# Altium schematic sheet BV100011_SDCARD.SchDoc
size A
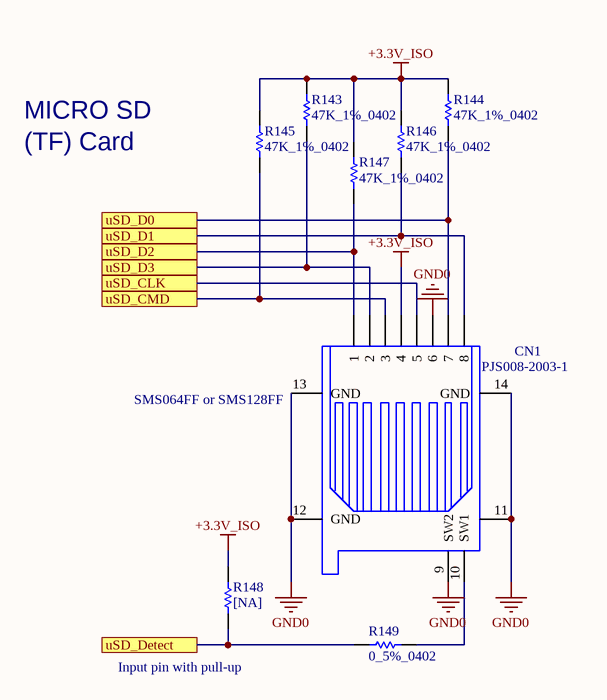
[diagram p0: BV100011_SDCARD.SchDoc]

## Parts
CN1  PJS008-2003-1  [PJS008-2003-1]
R143  47K_1%_0402  [0402R]
R144  47K_1%_0402  [0402R]
R145  47K_1%_0402  [0402R]
R146  47K_1%_0402  [0402R]
R147  47K_1%_0402  [0402R]
R148  [NA]  [0402R]
R149  0_5%_0402  [0402R]

## Ports
uSD_CLK, uSD_CMD, uSD_D0, uSD_D1, uSD_D2, uSD_D3, uSD_Detect

## Nets
+3.3V_ISO: CN1.4 R143.2 R144.2 R145.2 R146.2 R147.2 R148.2
GND0: CN1.6 CN1.9(SW2) CN1.11(GND) CN1.12(GND) CN1.13(GND) CN1.14(GND)
uSD_CLK: CN1.5 ; port uSD_CLK
uSD_CMD: CN1.3 R145.1 ; port uSD_CMD
uSD_D0: CN1.7 R144.1 ; port uSD_D0
uSD_D1: CN1.8 R146.1 ; port uSD_D1
uSD_D2: CN1.1 R147.1 ; port uSD_D2
uSD_D3: CN1.2 R143.1 ; port uSD_D3
uSD_Detect: R148.1 R149.1 ; port uSD_Detect
NetCN1_10: CN1.10(SW1) R149.2

## Notes on the sheet
- MICRO SD
- (TF) Card
- (near CN1) SMS064FF or SMS128FF
- (near R148) Input pin with pull-up

## Library data of the parts
CN1 = microSD-PJS008-2003: Memory Card Connectors MicroSD Card Conn Revrs Mnt Push-Push; Manuf_1: YAMAICHI; Manuf_Part_1: PJS008-2003-1; ECCN_US/EU: N/A; Order: PJS008-2003-1
R143-R147 = Res_47K_1%_0402: Resistor,47K,0402,1%,YAGEO; Manuf_Part_1: RC0402FR-0747KL; Order: 9239430; Value: 47K; Manuf_1: YAGEO; ECCN_US/EU: n/a; Distrib: FARNELL
R148 = Res_NA_0402: Resistor,[NA],0402; Fitted: NO; Value: [NA]; ECCN_US/EU: n/a
R149 = Res_0_5%_0402: Resistor,0,0402,5%,YAGEO; Manuf_Part_1: RC0402JR-070RL; Value: 0; Order: 2363467; ECCN_US/EU: n/a; Manuf_1: YAGEO; Distrib: FARNELL